# EAGLE design Rocket_End_sensors (EAGLE 7.3.0)
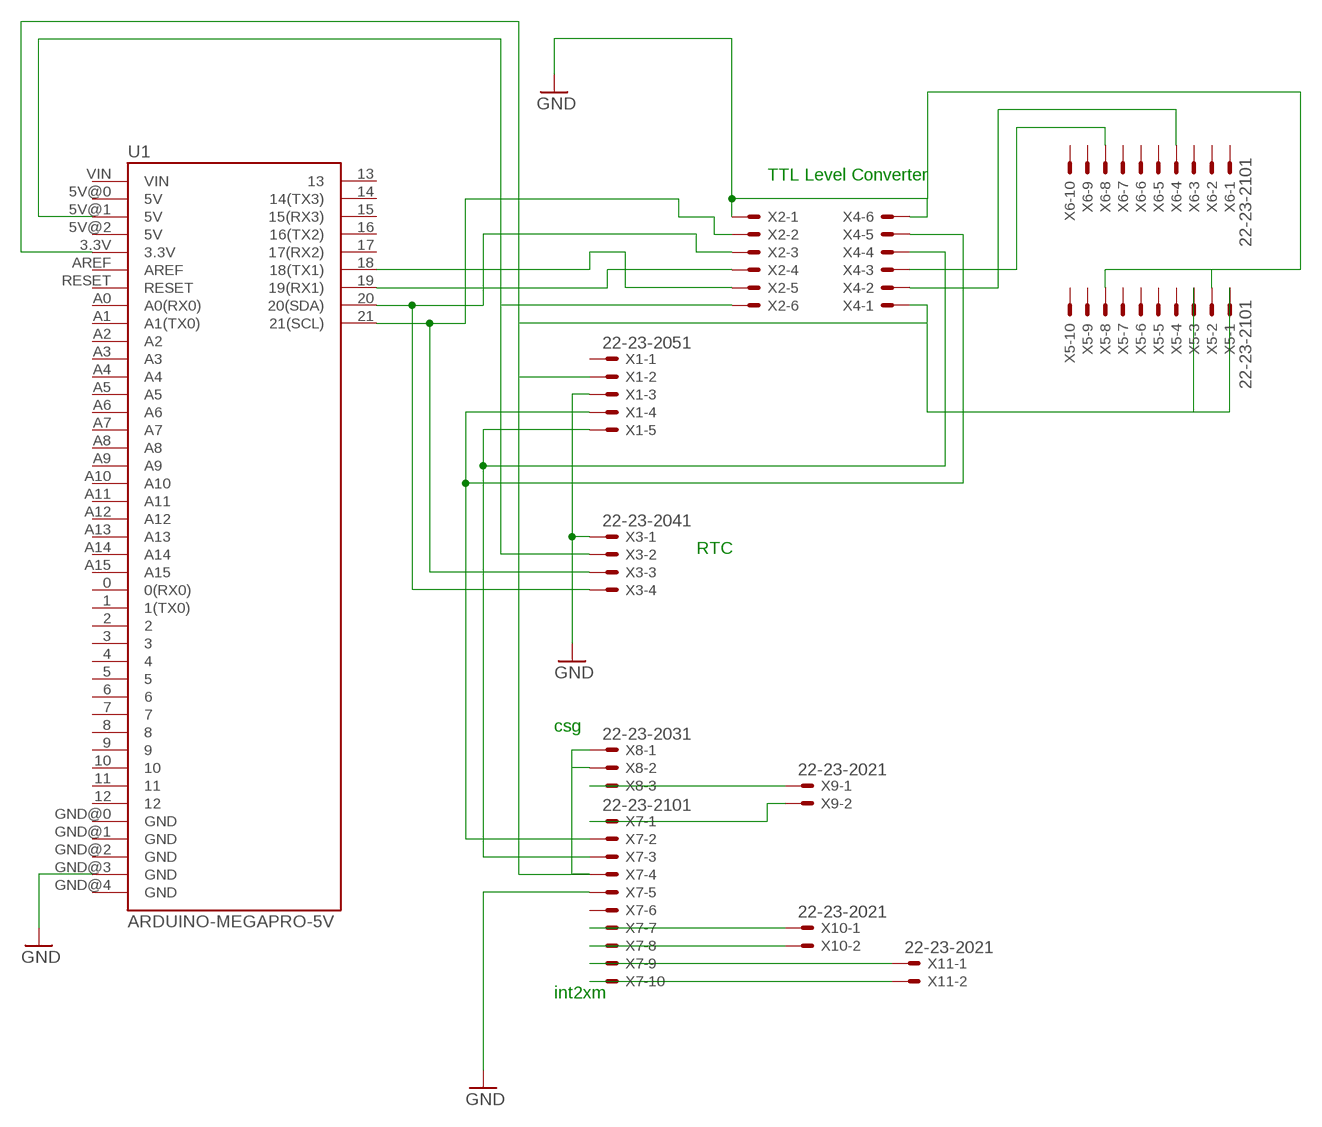
[diagram p0: schematic, sheet 1]

## Parts
U1  ARDUINO-MEGAPRO-5V  [ARDUINO_MEGA-PRO-5V]
X1  22-23-2051  [22-23-2051]
X2  22-23-2061  [22-23-2061]
X3  22-23-2041  [22-23-2041]
X4  22-23-2061  [22-23-2061]
X5  22-23-2101  [22-23-2101]
X6  22-23-2101  [22-23-2101]
X7  22-23-2101  [22-23-2101]
X8  22-23-2031  [22-23-2031]
X9  22-23-2021  [22-23-2021]
X10  22-23-2021  [22-23-2021]
X11  22-23-2021  [22-23-2021]

## Nets
GND: U1.GND@3(GND) X1.3 X2.1 X3.1 X4.6 X5.2 X5.8 X7.5
N$1: U1.19(19(RX1)) X2.4
N$2: U1.21(21(SCL)) X2.2 X3.3
N$3: U1.18(18(TX1)) X2.5
N$4: U1.3.3V X1.2 X4.1 X5.1 X5.3 X7.4 X8.1 X8.2
N$5: U1.20(20(SDA)) X2.3 X3.4
N$6: X4.3 X6.8
N$7: X8.3 X9.1
N$8: X4.2 X6.4
N$9: X7.1 X9.2
N$10: X7.7 X10.1
N$11: X7.8 X10.2
N$12: X7.9 X11.1
N$13: X7.10 X11.2
N$18: X1.5 X4.4 X7.3
N$24: X1.4 X4.5 X7.2
N$28: U1.5V@1(5V) X2.6 X3.2
Unconnected: U1.0(0(RX0)) U1.1(1(TX0)) U1.2 U1.3 U1.4 U1.5 U1.5V@0(5V) U1.5V@2(5V) U1.6 U1.7 U1.8 U1.9 U1.10 U1.11 U1.12 U1.13 U1.14(14(TX3)) U1.15(15(RX3)) U1.16(16(TX2)) U1.17(17(RX2)) U1.A0(A0(RX0)) U1.A1(A1(TX0)) U1.A2 U1.A3 U1.A4 U1.A5 U1.A6 U1.A7 U1.A8 U1.A9 U1.A10 U1.A11 U1.A12 U1.A13 U1.A14 U1.A15 U1.AREF U1.GND@0(GND) U1.GND@1(GND) U1.GND@2(GND) U1.GND@4(GND) U1.RESET U1.VIN X1.1 X5.4 X5.5 X5.6 X5.7 X5.9 X5.10 X6.1 X6.2 X6.3 X6.5 X6.6 X6.7 X6.9 X6.10 X7.6

## Notes on the sheet
- TTL Level Converter
- RTC
- csg
- int2xm

## Library data of the parts
U1 = JoeMega_Ether_Edited:ARDUINO-MEGA: Arduino Mega board footprint
X1 = con-molex:22-23-2051: .100" (2.54mm) Center Header - 5 Pin; MF: MOLEX; MPN: 22-23-2051; OC_FARNELL: 1462952; OC_NEWARK: 38C9178
X2 X4 = con-molex:22-23-2061: .100" (2.54mm) Center Header - 6 Pin; MF: MOLEX; MPN: 22-23-2061; OC_FARNELL: 1462922; OC_NEWARK: 27C1933
X3 = con-molex:22-23-2041: .100" (2.54mm) Center Header - 4 Pin; MF: MOLEX; MPN: 22-23-2041; OC_FARNELL: 1462920; OC_NEWARK: 38C0355
X5-X7 = con-molex:22-23-2101: .100" (2.54mm) Center Header - 10 Pin; MF: MOLEX; MPN: 22-23-2101; OC_FARNELL: 1756828; OC_NEWARK: 94C0765
X8 = con-molex:22-23-2031: .100" (2.54mm) Center Header - 3 Pin; MF: MOLEX; MPN: 22-23-2031; OC_FARNELL: 1462950; OC_NEWARK: 30C0862
X9-X11 = con-molex:22-23-2021: .100" (2.54mm) Center Header - 2 Pin; MF: MOLEX; MPN: 22-23-2021; OC_FARNELL: 1462926; OC_NEWARK: 25C3832

## Board
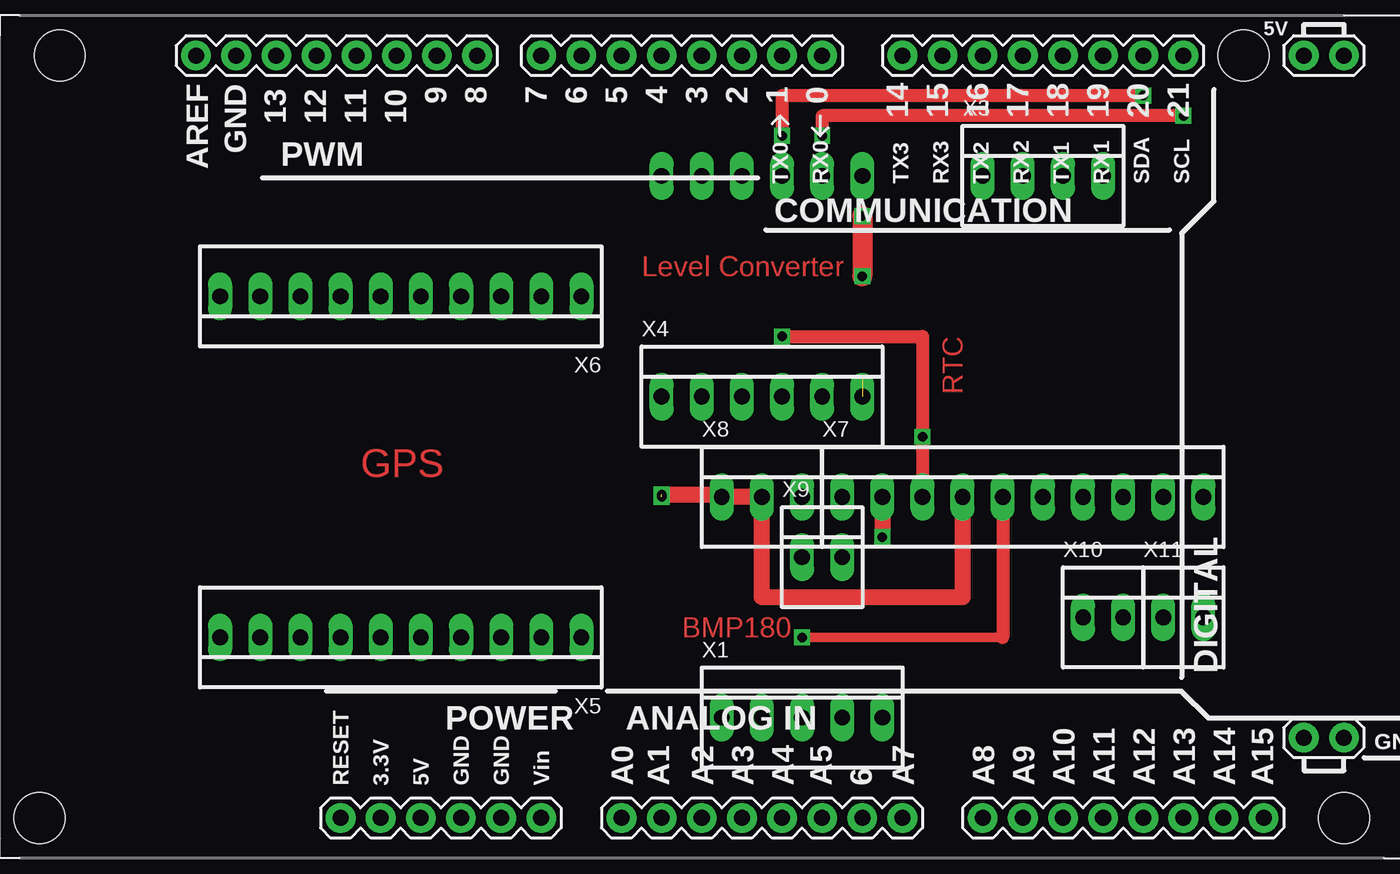
[diagram p1: board, top side]
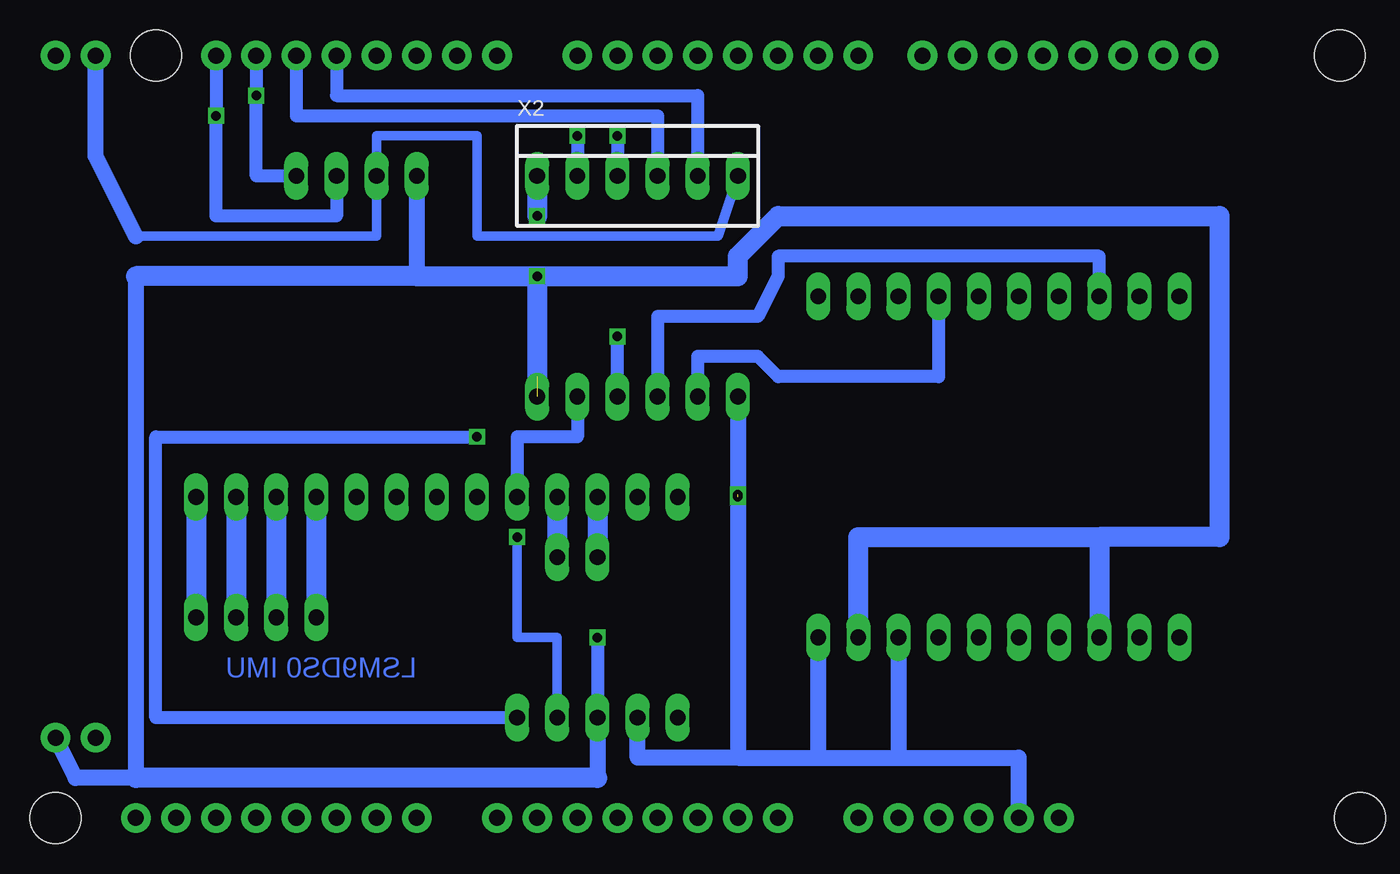
[diagram p2: board, bottom side, seen from below]

No outline drawn. Coordinates in mm, seen from the top.
Copper layers (1*16): Top 0.035mm / dielectric 1.5mm / Bottom 0.035mm
Design rules "default": minimum track width 10mil, minimum drill 24mil, track to track 8mil, track to pad 8mil, pad to pad 8mil, via to via 8mil, smd to smd 8mil, copper to edge 40mil, drill to drill 8mil, minimum pad ring 10mil, minimum via ring 8mil, stop-mask expansion 4mil, vias tented up to drill 0mil, thermal gap 10mil

### Footprints (pad centres in the part's own frame; a part is rotated, then mirrored left to right if it is on the bottom)
ARDUINO_MEGA-PRO-5V = drill 1.016 pad 1.88: 0 52.07,50.8; 1 49.53,50.8; 2 46.99,50.8; 3 44.45,50.8; 3.3V 24.13,2.54; 4 41.91,50.8; 5 39.37,50.8; 5V@0 26.67,2.54; 5V@1 82.55,50.8; 5V@2 85.09,50.8; 6 36.83,50.8; 7 34.29,50.8; 8 30.226,50.8; 9 27.686,50.8; 10 25.146,50.8; 11 22.606,50.8; 12 20.066,50.8; 13 17.526,50.8; 14 57.15,50.8; 15 59.69,50.8; 16 62.23,50.8; 17 64.77,50.8; 18 67.31,50.8; 19 69.85,50.8; 20 72.39,50.8; 21 74.93,50.8; A0 39.37,2.54; A1 41.91,2.54; A2 44.45,2.54; A3 46.99,2.54; A4 49.53,2.54; A5 52.07,2.54; A6 54.61,2.54; A7 57.15,2.54; A8 62.23,2.54; A9 64.77,2.54; A10 67.31,2.54; A11 69.85,2.54; A12 72.39,2.54; A13 74.93,2.54; A14 77.47,2.54; A15 80.01,2.54; AREF 12.446,50.8; GND@0 29.21,2.54; GND@1 31.75,2.54; GND@2 82.55,7.62; GND@3 85.09,7.62; GND@4 14.986,50.8; RESET 21.59,2.54; VIN 34.29,2.54 | hole 3.2: 3.81,50.8; 2.54,2.54; 78.74,50.8; 85.09,2.54
22-23-2051 = drill 1 long: 1 -5.08,0; 2 -2.54,0; 3 0,0; 4 2.54,0; 5 5.08,0
22-23-2061 = drill 1 long: 1 -6.35,0; 2 -3.81,0; 3 -1.27,0; 4 1.27,0; 5 3.81,0; 6 6.35,0
22-23-2041 = drill 1 long: 1 -3.81,0; 2 -1.27,0; 3 1.27,0; 4 3.81,0
22-23-2101 = drill 1 long: 1 -11.43,0; 2 -8.89,0; 3 -6.35,0; 4 -3.81,0; 5 -1.27,0; 6 1.27,0; 7 3.81,0; 8 6.35,0; 9 8.89,0; 10 11.43,0
22-23-2031 = drill 1 long: 1 -2.54,0; 2 0,0; 3 2.54,0
22-23-2021 = drill 1 long: 1 -1.27,0; 2 1.27,0

### Placement (x,y rotation side)
U1  3.81,7.62 0 top
X1  54.61,16.51 0 top
X2  52.07,50.8 0 bottom
X3  69.85,50.8 0 top
X4  52.07,36.83 0 top
X5  29.21,21.59 180 top
X6  29.21,43.18 180 top
X7  68.58,30.48 0 top
X8  52.07,30.48 0 top
X9  55.88,26.67 0 top
X10  73.66,22.86 0 top
X11  78.74,22.86 0 top

### Tracks (layer width: path | path; a pad name or v marks a point on that pad's centre or on a via)
GND  (via drill 0.6)  (1 unrouted)
  Top 0.61: 67.31,21.59 v54.61,21.59
  Top 0.813: X7.5 67.31,21.59
  Top 1.27: v58.42,48.26 v58.42,44.45
  Bottom 0.813: v54.61,21.59 X1.3
  Bottom 1.016: X3.1 66.04,44.45 | 83.82,44.45 83.82,12.7 87.63,12.7 U1.GND@3 | X1.3 54.61,12.7
  Bottom 1.27: 83.82,44.45 66.04,44.45 v58.42,44.45 | 54.61,12.7 83.82,12.7 | X5.2 38.1,27.94 22.86,27.94 | 22.86,27.94 X5.8 | v58.42,44.45 45.72,44.45 45.72,45.72 43.18,48.26 15.24,48.26 15.24,27.94 22.86,27.94 | X2.1 v58.42,48.26 | v58.42,44.45 58.42,38.1
N$1
  Bottom 0.813: U1.19 73.66,54.61 50.8,54.61 X2.4
N$2  (via drill 0.6)
  Top 0.813: v78.74,54.61 55.88,54.61 v55.88,53.34
  Bottom 0.813: U1.21 v78.74,54.61 78.74,48.26 71.12,48.26 X3.3 | v55.88,53.34 X2.2
N$3
  Bottom 0.813: U1.18 71.12,55.88 48.26,55.88 X2.5
N$4  (via drill 0.6)  (1 unrouted)
  Top 0.254: 49.38,30.63 X8.1
  Top 1.016: v45.72,30.63 49.38,30.63 | X8.1 X8.2 52.07,24.13 64.77,24.13 X7.4
  Bottom 1.016: U1.3.3V 27.94,13.97 35.56,13.97 | 45.72,13.97 40.64,13.97 | X4.1 v45.72,30.63 | v45.72,30.48 45.72,13.97 | 45.72,13.97 52.07,13.97 X1.2 | 40.64,13.97 35.56,13.97 | X5.1 40.64,13.97 | X5.3 35.56,13.97
N$5  (via drill 0.6)
  Top 0.813: v76.2,55.88 53.34,55.88 v53.34,53.34
  Bottom 0.813: U1.20 v76.2,55.88 76.2,50.8 X3.4 | v53.34,53.34 X2.3
N$6
  Bottom 0.813: X6.8 22.86,45.72 43.18,45.72 43.18,44.45 44.45,41.91 50.8,41.91 X4.3
N$7
  Bottom 1.27: X8.3 X9.1
N$8
  Bottom 0.813: X6.4 33.02,38.1 43.18,38.1 44.45,39.37 48.26,39.37 X4.2
N$9
  Bottom 1.27: X7.1 X9.2
N$10
  Bottom 1.27: X10.1 X7.7
N$11
  Bottom 1.27: X7.8 X10.2
N$12
  Bottom 1.27: X7.9 X11.1
N$13
  Bottom 1.27: X7.10 X11.2
N$18  (via drill 0.6)
  Top 0.813: v53.34,40.64 62.23,40.64 v62.23,34.29 X7.3
  Bottom 0.813: X4.4 v53.34,40.64 | X1.5 82.55,16.51 82.55,34.29 v62.23,34.29
N$24  (via drill 0.6)
  Top 1.016: X7.2 v59.69,27.94
  Bottom 0.61: v59.69,27.94 59.69,21.59 57.15,21.59 X1.4
  Bottom 0.813: X4.5 55.88,34.29 59.69,34.29 X7.2
N$28
  Bottom 0.61: 83.82,46.99 68.58,46.99 X3.2 68.58,53.34 62.23,53.34 62.23,46.99 46.99,46.99 X2.6
  Bottom 1.016: 83.82,46.99 86.36,52.07 U1.5V@1

### Text on the board
Top: Level Converter | RTC | GPS | BMP180
Bottom: LSM9DS0 IMU